# EAGLE design messen (EAGLE 6.5.0)
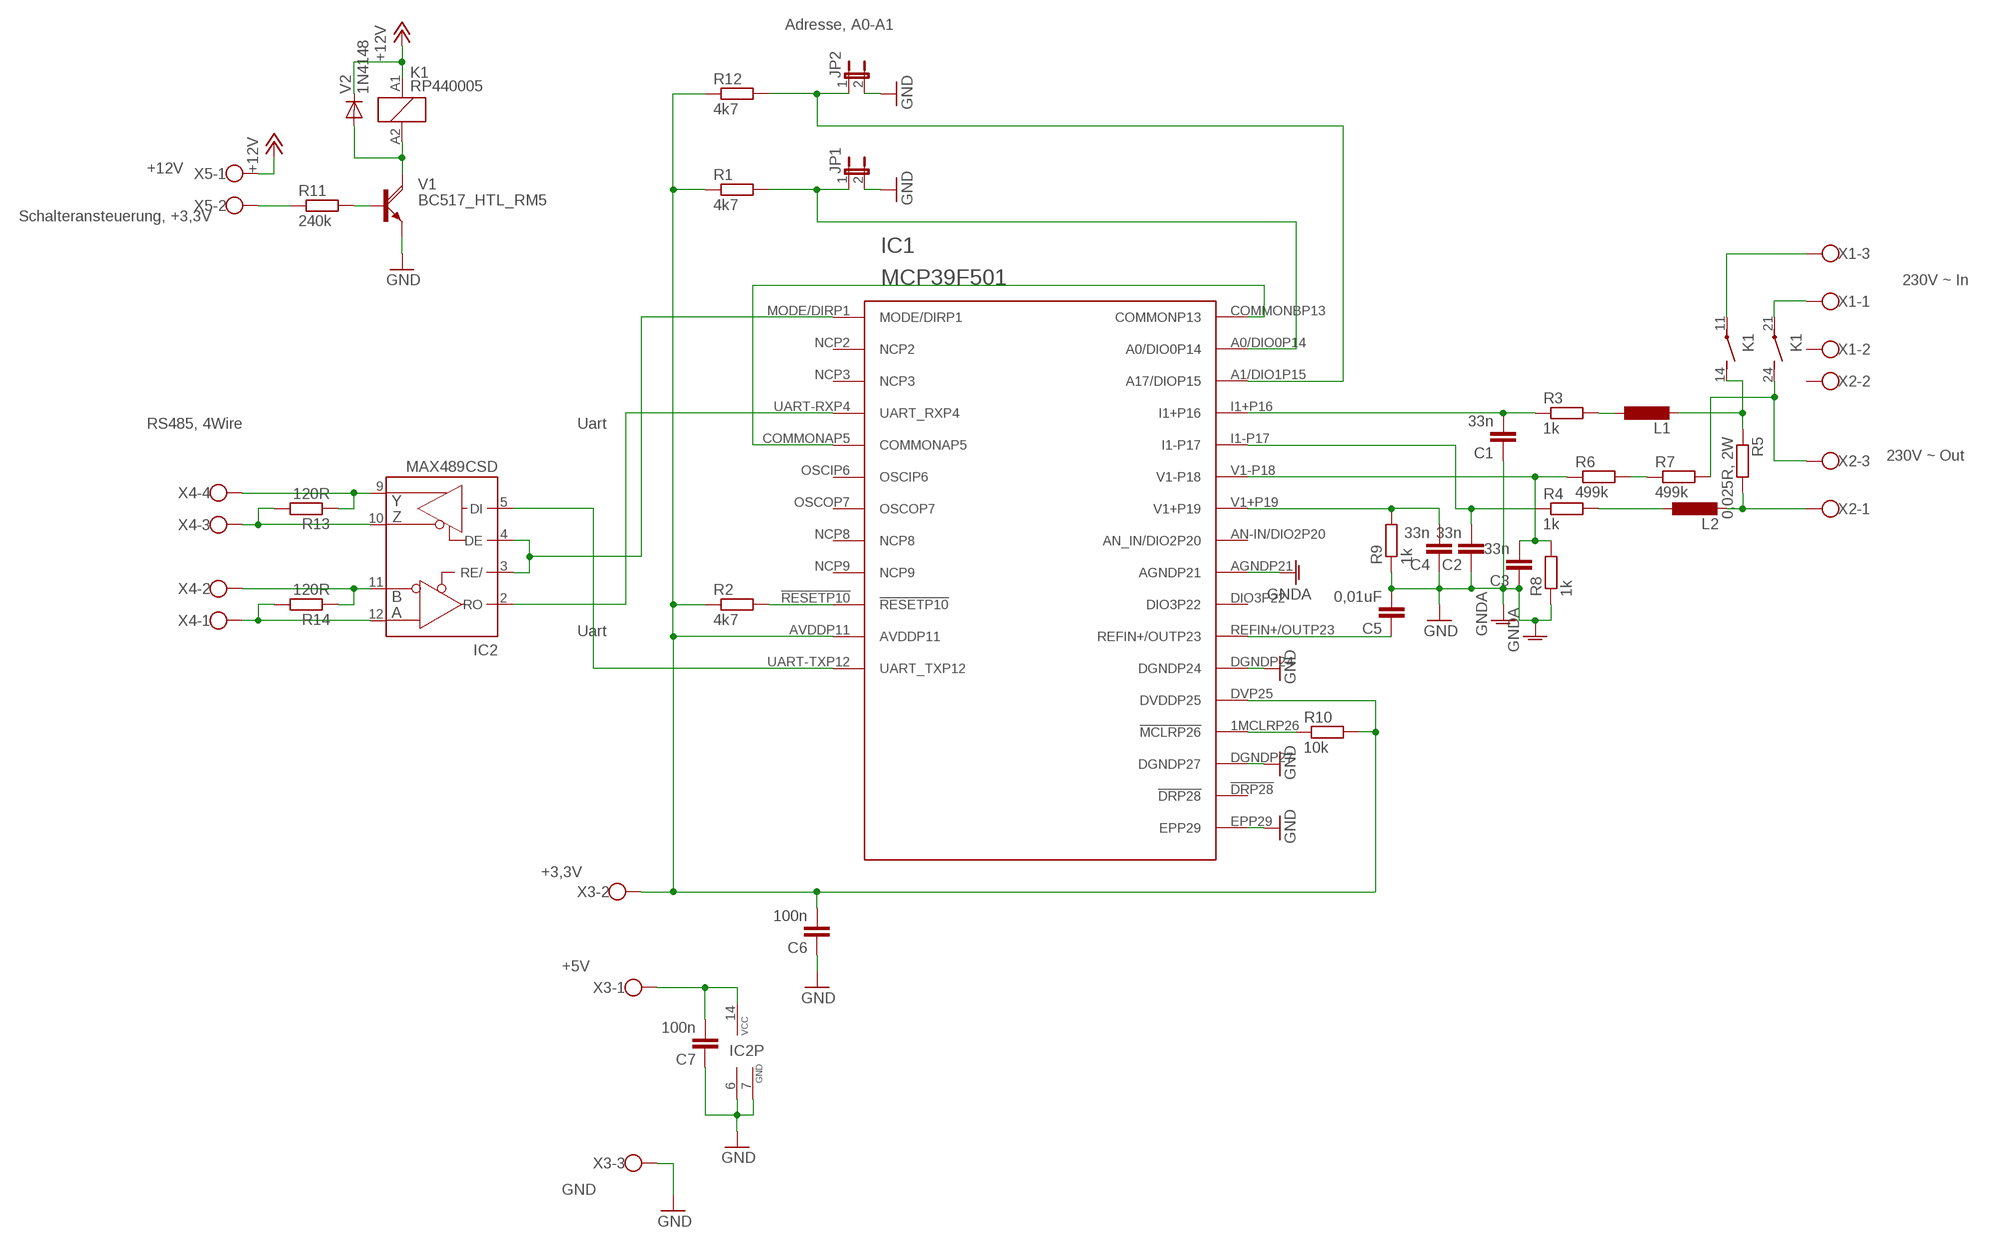
[diagram p0: schematic, sheet 1]

## Parts
C1  33n  C-EUC0805K  [C0805K]
C2  33n  C-EUC0805K  [C0805K]
C3  33n  C-EUC0805K  [C0805K]
C4  33n  C-EUC0805K  [C0805K]
C5  0,01uF  C-EUC0805K  [C0805K]
C6  100n  C-EUC0805K  [C0805K]
C7  100n  C-EUC0805K  [C0805K]
IC1  MCP39F501  [MCP39F501]
IC2  MAX489CSD  [SO14]
JP1  JP1E  [JP1]
JP2  JP1E  [JP1]
K1  RP440005  [RP440]
L1  L-EUL3230M  [L3230M]
L2  L-EUL3230M  [L3230M]
R1  4k7  R-EUR0805  [R0805]
R2  4k7  R-EU0411/15  [0411/15]
R3  1k  R-EUR0805  [R0805]
R4  1k  R-EUR0805  [R0805]
R5  0,025R, 2W  R-EUR2512  [R2512]
R6  499k  R-EU0411/15  [0411/15]
R7  499k  R-EU0411/15  [0411/15]
R8  1k  R-EUR0805  [R0805]
R9  1k  R-EUR0805  [R0805]
R10  10k  R-EU0204/7  [0204/7]
R11  240k  R-EU0411/15  [0411/15]
R12  4k7  R-EUR0805  [R0805]
R13  120R  R-EUR0805  [R0805]
R14  120R  R-EUR0805  [R0805]
V1  BC517_HTL_RM5  [TO92_RM5]
V2  1N4148  1N4148_HTL  [DO35-7]
X1  W237-103_R  [W237-103_R]
X2  W237-103_R  [W237-103_R]
X3  W237-103_L  [W237-103_L]
X4  W237-04P_L  [W237-4P_L]
X5  W237-102_L  [W237-102_L]

## Nets
+12V: K1.A1 V2.C X5.1
GND: C1.1 C2.1 C3.1 C4.1 C5.2 C6.1 C7.1 IC1.AGNDP21 IC1.DGNDP24 IC1.DGNDP27 IC1.EPP29 IC2.6(GND) IC2.7(GND) JP1.2 JP2.2 R8.1 R9.1 V1.1(E) X3.3 ; supply symbol labelled GNDA
N$1: R11.1 X5.2
N$2: IC1.UART-RXP4(UART_RXP4) IC2.2(RO)
N$3: IC1.MODE/DIRP1 IC2.3(RE/) IC2.4(DE)
N$4: IC1.!RESETP10 R2.2
N$5: C1.2 IC1.I1+P16 R3.1
N$6: C2.2 IC1.I1-P17 R4.1
N$7: C4.2 IC1.V1+P19 R9.2
N$8: K1.A2 V1.3(C) V2.A
N$9: L1.1 R3.2
N$10: L2.1 R4.2
N$11: L2.2 R5.2 X2.1
N$12: K1.11(2:P) X1.3
N$13: C5.1 IC1.REFIN+/OUTP23
N$14: C3.2 IC1.V1-P18 R6.1 R8.2
N$15: C6.2 IC1.AVDDP11 IC1.DVP25(DVDDP25) R1.1 R2.1 R10.2 R12.1 X3.2
N$16: IC1.1MCLRP26(!MCLRP26) R10.1
N$17: R11.2 V1.2(B)
N$18: R6.2 R7.1
N$19: K1.14(2:S) L1.2 R5.1
N$20: K1.24(3:S) R7.2 X2.3
N$21: K1.21(3:P) X1.1
N$22: IC1.UART-TXP12(UART_TXP12) IC2.5(DI)
N$23: C7.2 IC2.14(VCC) X3.1
N$24: IC1.COMMONAP5 IC1.COMMONBP13(COMMONP13)
N$25: IC2.10(Z) R13.2 X4.3
N$26: IC2.9(Y) R13.1 X4.4
N$27: IC1.A0/DIO0P14 JP1.1 R1.2
N$28: IC1.A1/DIO1P15(A17/DIOP15) JP2.1 R12.2
N$29: IC2.11(B) R14.1 X4.2
N$32: IC2.12(A) R14.2 X4.1
Unconnected: IC1.!DRP28 IC1.AN-IN/DIO2P20(AN_IN/DIO2P20) IC1.DIO3P22 IC1.NCP2 IC1.NCP3 IC1.NCP8 IC1.NCP9 IC1.OSCIP6 IC1.OSCOP7 IC2.1(NC) IC2.8(NC) IC2.13(NC) X1.2 X2.2

## Notes on the sheet
- Adresse, A0-A1
- +12V
- Schalteransteuerung, +3,3V
- 230V ~ In
- RS485, 4Wire | Uart
- 230V ~ Out
- Uart
- +3,3V
- +5V
- GND

## Library data of the parts
C1-C7 = HTL_RCL:C-EU: CAPACITOR, European symbol
IC1 = Microchip_MCP:MCP39F501
IC2 = maxim:MAX489CSD: RS485 TRANSEIVER; MF: MAXIM; MPN: MAX489CSD; OC_FARNELL: 9724559; OC_NEWARK: 34C3923
JP1 JP2 = jumper:JP1E: JUMPER
K1 = relay:RP44?*: Power PCB Relay RP II/2 Schrack 2 pole 8 A Source: http://www.schrack.com/.. 5844.pdf; OC_FARNELL: unknown; OC_NEWARK: unknown
L1 L2 = HTL_RCL:L-EU: INDUCTOR, European symbol
R1-R14 = HTL_RCL:R-EU: RESISTOR, European symbol
V1 = HTL_Transistor:BC517_HTL_RM5: NPN DARLINGTON TRANSISTOR
V2 = HTL_Diode:1N4148_HTL: DIODE high speed (Philips)
X1 X2 = HTL_Printklemmen_rechts:W237-103_R: WAGO SCREW CLAMP
X3 = HTL_Printklemmen_links:W237-103_L: WAGO SCREW CLAMP
X4 = HTL_Printklemmen_links:W237-04P_L: WAGO SREW CLAMP
X5 = HTL_Printklemmen_links:W237-102_L: WAGO SCREW CLAMP

## Board
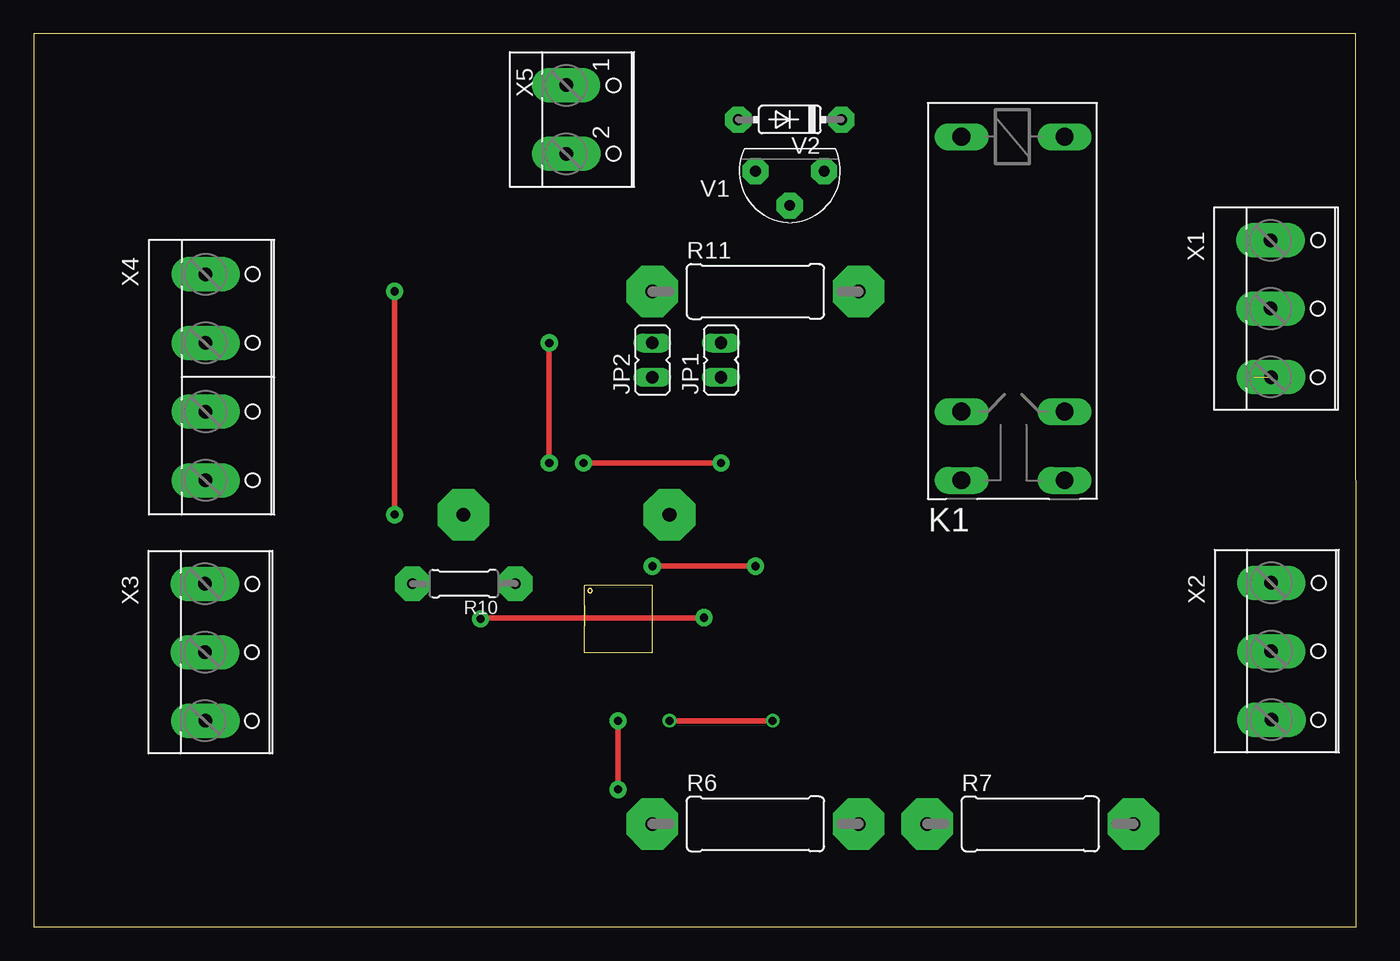
[diagram p1: board, top side]
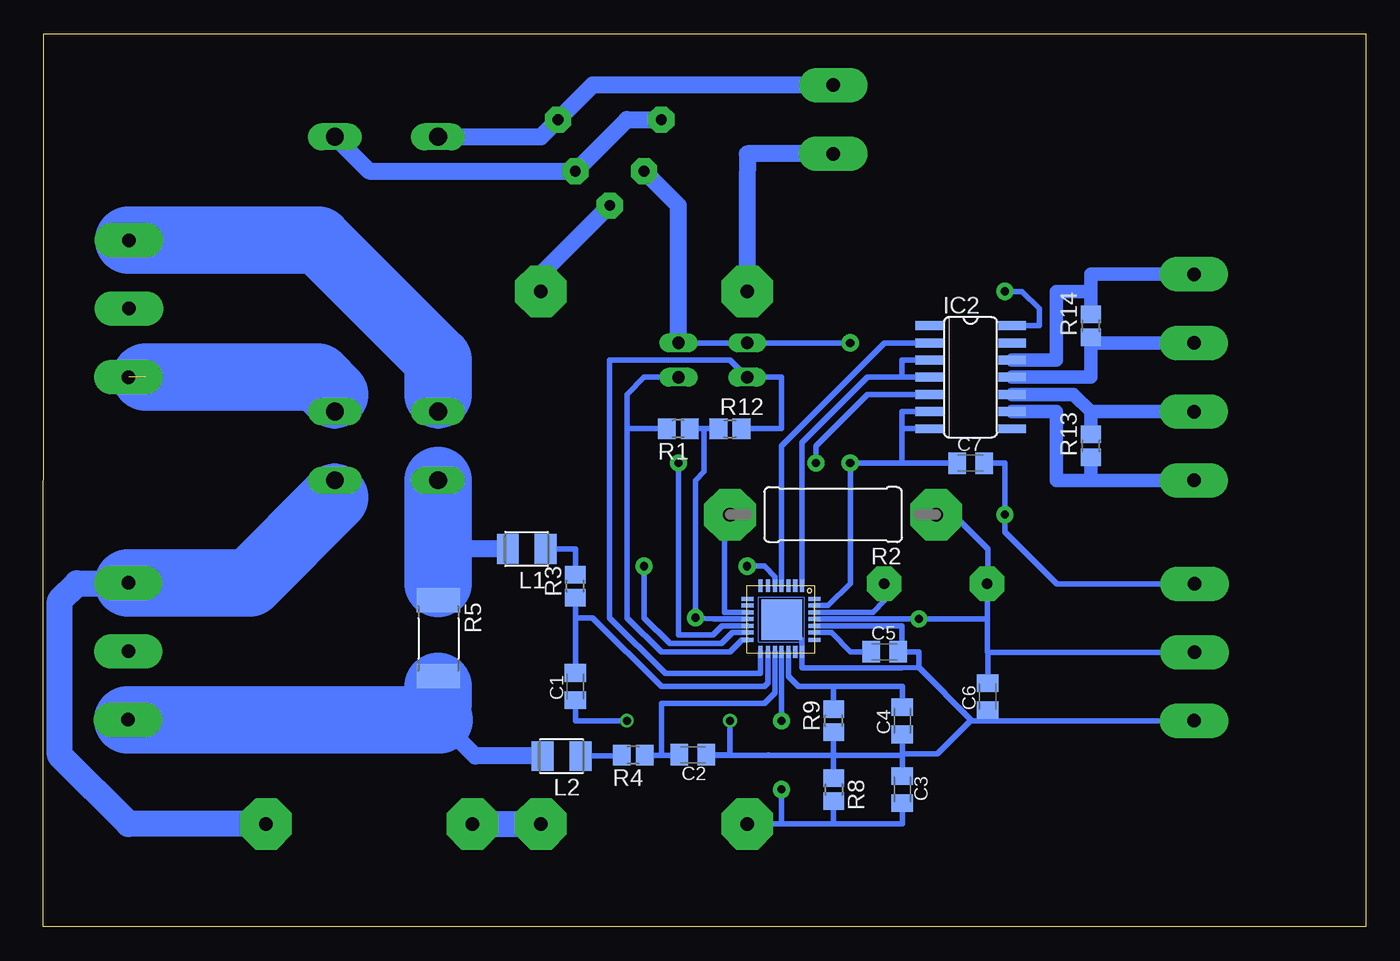
[diagram p2: board, bottom side, seen from below]

Size 97.75 x 66.03 mm. Coordinates in mm from the lower left corner, seen from the top.
Outline: 0,0 97.75,0 97.71,66.03 0,66.03 0,0
Copper layers (1*16): Top 0.035mm / dielectric 1.5mm / Bottom 0.035mm
Design rules "default": minimum track width 10mil, minimum drill 24mil, track to track 8mil, track to pad 8mil, pad to pad 8mil, via to via 8mil, smd to smd 8mil, copper to edge 40mil, drill to drill 8mil, minimum pad ring 10mil, minimum via ring 8mil, stop-mask expansion 4mil, vias tented up to drill 0mil, thermal gap 10mil

### Footprints (pad centres in the part's own frame; a part is rotated, then mirrored left to right if it is on the bottom)
C0805K = smd 1.3 x 1.6: 1 -1,0; 2 1,0
MCP39F501 = smd 0.3 x 0.9: 1MCLRP26 2,4.983; !DRP28 1,4.983; !RESETP10 2,0.033; A0/DIO0P14 4.05,0.033; AVDDP11 2.5,0.033; COMMONBP13 3.5,0.033; DGNDP24 3,4.983; DGNDP27 1.5,4.983; DIO3P22 4.05,4.983; DVP25 2.5,4.983; NCP8 1,0.033; NCP9 1.5,0.033; REFIN+/OUTP23 3.5,4.983; UART-TXP12 3,0.033 | smd 0.9 x 0.3: A1/DIO1P15 4.933,1; AGNDP21 4.933,4.05; AN-IN/DIO2P20 4.933,3.55; COMMONAP5 0.033,2.05; I1+P16 4.933,1.55; I1-P17 4.933,2.05; MODE/DIRP1 0.033,4.05; NCP2 0.033,3.55; NCP3 0.033,3.05; OSCIP6 0.033,1.55; OSCOP7 0.033,1; UART-RXP4 0.033,2.55; V1+P19 4.933,3.05; V1-P18 4.933,2.55 | smd 3 x 3: EPP29 2.55,2.55
SO14 = smd 0.66 x 2.032: 1 -3.81,-3.073; 2 -2.54,-3.073; 3 -1.27,-3.073; 4 0,-3.073; 5 1.27,-3.073; 6 2.54,-3.073; 7 3.81,-3.073; 8 3.81,3.073; 9 2.54,3.073; 10 1.27,3.073; 11 0,3.073; 12 -1.27,3.073; 13 -2.54,3.073; 14 -3.81,3.073
JP1 = drill 0.914 long: 1 0,-1.27; 2 0,1.27
RP440 = drill 1.321 long: 11 16.51,-3.81; 14 21.59,-3.81; 21 16.51,3.81; 24 21.59,3.81; A1 -3.81,-3.81; A2 -3.81,3.81
L3230M = smd 1.6 x 2.2: 1 -1.4,0; 2 1.4,0
R0805 = smd 1.3 x 1.5: 1 -0.85,0; 2 0.85,0
0411/15 = drill 1 pad 3.81 octagon: 1 -7.62,0; 2 7.62,0
R2512 = smd 1.8 x 3.2: 1 -2.8,0; 2 2.8,0
0204/7 = drill 0.8 pad 2.54 octagon: 1 -3.81,0; 2 3.81,0
TO92_RM5 = drill 0.8 pad 1.93 octagon: 1 3.81,0; 2 1.27,2.54; 3 -1.27,0
DO35-7 = drill 0.8 pad 1.93 octagon: A 3.81,0; C -3.81,0
W237-103_R = drill 1 pad 2.54 long: 1 5.076,0.005; 2 0,-0.02; 3 -5.051,-0.02
W237-103_L = drill 1 pad 2.54 long: 1 -5.051,-0.02; 2 0,-0.02; 3 5.076,0.005
W237-4P_L = drill 1 pad 2.54 long: 1 -7.62,0; 2 -2.54,0; 3 2.54,0; 4 7.62,0
W237-102_L = drill 1 pad 2.54 long: 1 -2.551,-0.025; 2 2.525,0

### Placement (x,y rotation side)
C1  58.42,17.78 90 bottom
C2  49.73,12.73 180 bottom
C3  34.25,10.16 270 bottom
C4  34.25,15.24 90 bottom
C5  35.56,20.34 0 bottom
C6  27.94,17.03 90 bottom
C7  29.21,34.29 0 bottom
IC1  45.72,25.27 270 bottom
IC2  29.21,40.64 270 bottom
JP1  50.8,41.91 0 top
JP2  45.72,41.91 0 top
K1  72.39,54.61 270 top
L1  62.02,27.94 180 bottom
L2  59.44,12.63 180 bottom
R1  50.8,36.83 180 bottom
R2  39.37,30.48 180 bottom
R3  58.42,25.19 90 bottom
R4  54.15,12.7 180 bottom
R5  68.54,21.34 270 bottom
R6  53.34,7.62 0 top
R7  73.66,7.62 0 top
R8  39.33,10.16 270 bottom
R9  39.33,15.24 90 bottom
R10  31.79,25.38 180 top
R11  53.34,46.99 0 top
R12  46.99,36.83 0 bottom
R13  20.32,35.56 90 bottom
R14  20.32,44.45 90 bottom
V1  57.15,55.88 180 top
V2  55.88,59.69 180 top
X1  91.44,45.72 270 top
X2  91.49,20.39 270 top
X3  12.67,20.31 270 top
X4  12.7,40.64 270 top
X5  39.37,59.69 270 top

### Tracks (layer width: path | path; a pad name or v marks a point on that pad's centre or on a via)
+12V
  Bottom 1.27: K1.A1 60.96,58.42 V2.C 57.14,62.24 X5.1
GND  (via drill 0.6, 0.6 pad 1.27)  (1 unrouted)
  Top 0.406: v38.1,34.29 v38.1,43.18 | v46.99,15.24 v54.61,15.24
  Bottom 0.4: IC1.AGNDP21 41.67,21.21 IC1.EPP29 | X3.3 25.4,15.24 | 43.18,22.86 43.32,22.86 IC1.EPP29 | 42.72,22.27 IC1.EPP29
  Bottom 0.406: 43.18,12.7 46.99,12.7 | 46.99,12.7 48.71,12.7 | R9.1 39.33,12.7 | 39.33,12.7 R8.1 | 44.16,12.72 43.18,12.7 | 43.18,12.7 39.33,12.7 | JP1.2 JP2.2 v38.1,43.18 | C6.1 27.94,15.24 | 25.4,15.24 27.94,15.24 | IC1.AGNDP21 41.67,19.2 41.63,19.16 34.3,19.16 33.02,19.17 | 33.02,19.17 33.02,20.32 33.04,20.34 C5.2 34.29,20.61 34.29,22.27 IC1.DGNDP24 | 27.94,15.24 29.09,15.24 | 29.09,15.24 33.02,19.17 | 29.09,15.24 29.21,15.24 31.65,12.8 34.15,12.8 34.25,12.7 | IC1.DGNDP27 39.73,23.77 38.1,25.4 v38.1,34.29 34.29,34.29 | C2.1 47.02,12.73 46.99,12.7 | 46.99,12.7 v46.99,15.24 | C1.1 58.42,15.24 v54.61,15.24 | 34.25,12.7 C4.1 34.25,12.74 34.29,12.7 39.33,12.7 | 34.25,12.7 C3.1 | IC2.6 34.29,38.1 34.29,36.83 | IC2.7 34.29,36.83 | C7.1 34.29,34.29 | 34.29,34.29 34.29,36.83
  Bottom 1.27: 48.71,12.7 C2.1 | JP1.2 50.8,53.34 V1.1
N$1
  Bottom 1.27: X5.2 45.7,57.16 45.72,54.61 R11.1 45.72,45.72
N$2
  Bottom 0.406: IC1.UART-RXP4 43.17,35.57 35.56,43.18 IC2.2
N$3
  Bottom 0.406: IC2.3 34.29,41.91 34.29,40.64 | 34.29,40.64 IC2.4 | 34.29,40.64 36.83,40.64 41.67,35.8 IC1.MODE/DIRP1
N$4
  Bottom 0.406: IC1.!RESETP10 47.4,23.27 47.4,30.07 R2.2
N$5
  Bottom 0.406: IC1.I1+P16 44.17,18.06 44.45,17.78 52.07,17.78 57.15,22.86 58.42,22.86 | R3.1 58.42,22.86 | C1.2 58.42,22.86
N$6
  Bottom 0.406: R4.1 52.07,12.7 | 52.07,12.7 50.76,12.7 C2.2 | IC1.I1-P17 43.67,17.29 44.45,16.51 52.07,16.51 52.07,12.7
N$7
  Bottom 0.4: IC1.V1+P19 42.67,18.54 41.91,17.78 39.33,17.78
  Bottom 0.406: C4.2 34.25,17.78 39.33,17.78 R9.2
N$8
  Bottom 1.27: K1.A2 73.66,55.88 V1.3 54.61,59.69 V2.A
N$9
  Bottom 0.406: L1.1 58.42,27.94 R3.2
N$10
  Bottom 0.406: L2.1 55.07,12.63 R4.2
N$11
  Bottom 0.406: 68.51,15.31 68.58,16.51
  Bottom 1.27: L2.2 65.83,12.63 68.51,15.31
  Bottom 2: 68.58,17.78 68.58,18.5 R5.2
  Bottom 5: X2.1 68.51,15.31 | 68.58,16.51 68.58,17.78
N$12
  Bottom 2.54: 68.58,39.37 K1.11
  Bottom 5: X1.3 77.44,50.77 68.58,41.91 68.58,39.37
N$13
  Bottom 0.406: C5.1 38.08,20.34 | 38.08,20.34 38.1,20.32 | IC1.REFIN+/OUTP23 39.5,21.77 38.08,20.34
N$14  (via drill 0.6 pad 1.27)
  Top 0.406: v43.18,15.24 v43.18,10.16
  Bottom 0.406: 39.33,7.62 R8.2 | C3.2 34.25,7.62 39.33,7.62 | 39.33,7.62 43.18,7.62 | 43.18,7.62 R6.1 | IC1.V1-P18 v43.18,15.24 | v43.18,10.16 43.18,7.62
N$15  (via drill 0.6 pad 1.27)
  Top 0.406: v49.53,22.86 33.12,22.86 v33.02,22.77
  Bottom 0.4: IC1.DVP25 36.41,22.77 | X3.2 27.94,20.31
  Bottom 0.406: C6.2 27.94,20.31 27.98,20.35 27.98,22.86 | 36.41,22.77 v33.02,22.77 28.07,22.77 27.98,22.86 | R12.1 48.9,36.83 | 27.98,22.86 R10.2 27.94,25.42 | R1.1 48.9,36.83 | 48.9,36.83 48.9,33.66 49.53,33.02 v49.53,22.86 48.16,22.77 IC1.AVDDP11 | 27.94,25.42 27.96,25.42 | R2.1 30.48,30.48 27.94,27.94 27.94,25.42
N$16
  Bottom 0.406: IC1.1MCLRP26 36.43,23.27 35.56,24.13 35.56,25.34 R10.1
N$17
  Bottom 1.27: R11.2 60.96,48.26 V1.2
N$18
  Bottom 1.93: R7.1 R6.2
N$19
  Bottom 1.27: L1.2 68.58,27.94
  Bottom 2: 68.58,25.4 68.58,24.18 R5.1
  Bottom 5: K1.14 68.58,27.94 68.58,25.4
N$20
  Bottom 1.27: 88.97,25.4 X2.3
  Bottom 1.93: 88.97,25.4 95.25,25.4 96.52,24.13 96.52,12.7 91.44,7.62 R7.2
  Bottom 2.54: 76.2,31.75 K1.24
  Bottom 5: X2.3 82.51,25.44 76.2,31.75
N$21  (1 unrouted)
  Bottom 2.54: 76.2,39.37 K1.21
  Bottom 5: 90.17,40.64 77.47,40.64 76.2,39.37
N$22  (via drill 0.6 pad 1.27)
  Top 0.406: v40.64,34.29 v50.8,34.29
  Bottom 0.406: IC2.5 36.83,39.37 40.64,35.56 v40.64,34.29 | IC1.UART-TXP12 47.59,22.27 48.26,21.59 50.8,21.59 v50.8,34.29
N$23  (via drill 0.6 pad 1.27)
  Top 0.406: v26.67,30.48 v26.67,46.99
  Bottom 0.406: v26.67,46.99 25.4,46.99 24.13,45.72 24.13,44.45 IC2.14 | C7.2 26.67,34.29 v26.67,30.48 26.67,29.21 22.83,25.36 X3.1
N$24  (via drill 0.6 pad 1.27)
  Top 0.406: v45.72,26.67 v53.34,26.67
  Bottom 0.406: IC1.COMMONBP13 46.82,21.77 47.62,20.96 51.44,20.96 53.34,22.86 v53.34,26.67 | IC1.COMMONAP5 43.67,25.89 44.45,26.67 v45.72,26.67
N$25
  Bottom 1.016: R13.2 20.32,38.1 | 20.32,38.1 X4.3 | IC2.10 21.59,39.37 20.32,38.1
N$26
  Bottom 1.016: X4.4 20.32,33.02 | 20.32,33.02 R13.1 | IC2.9 22.86,38.1 22.86,33.02 20.32,33.02
N$27
  Bottom 0.406: JP1.1 53.34,40.64 54.61,39.37 54.61,36.83 | IC1.A0/DIO0P14 46.09,21.21 46.99,20.32 52.07,20.32 54.61,22.86 54.61,36.83 | R1.2 54.61,36.83
N$28
  Bottom 0.406: IC1.A1/DIO1P15 44.72,18.78 44.77,18.73 51.75,18.73 55.88,22.86 55.88,41.91 46.99,41.91 JP2.1 43.18,40.64 43.18,36.83 R12.2
N$29
  Bottom 1.016: IC2.11 20.32,40.64 20.32,43.18 | X4.2 20.32,43.18 | 20.32,43.18 R14.1
N$32
  Bottom 1.016: R14.2 20.32,46.99 | 20.32,46.99 20.32,48.26 X4.1 | IC2.12 22.86,41.91 22.86,46.99 20.32,46.99